# EAGLE design boxiangf-SMD (EAGLE 9.6.2)
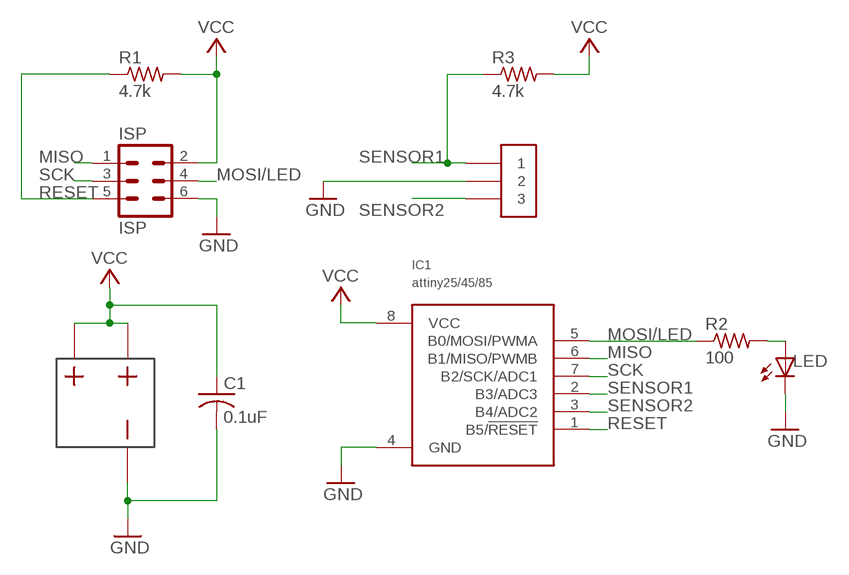
[diagram p0: schematic, sheet 1]

## Parts
C1  0.1uF  CAPACITORSM_CAP  [C0402]
IC1  attiny25/45/85  ATTINY25SM_ATTINY  [8S1]
ISP  ISP  6PINCON_ISPSM_6PIN  [SM6PIN]
LED  LEDSMLED  [CHIPLED_0603]
R1  4.7k  RESISTORSMRESISTOR  [R0402]
R2  100  RESISTORSMRESISTOR  [R0402]
R3  4.7k  RESISTORSMRESISTOR  [R0402]
SENSE  3PINCONSM_3PIN  [SM3PIN]
US1  BATTERYSM_BA2032  [BA2032SM]

## Nets
GND: C1.2 IC1.4(GND) ISP.6 LED.C SENSE.2 US1.1
MISO: IC1.6(B1/MISO/PWMB) ISP.1
MOSI/LED: IC1.5(B0/MOSI/PWMA) ISP.4 R2.1
N$2: LED.A R2.2
RESET: IC1.1(B5/!RESET) ISP.5 R1.1
SCK: IC1.7(B2/SCK/ADC1) ISP.3
SENSOR1: IC1.2(B3/ADC3) R3.1 SENSE.1
SENSOR2: IC1.3(B4/ADC2) SENSE.3
VCC: C1.1 IC1.8(VCC) ISP.2 R1.2 R3.2 US1.2 US1.3

## Library data of the parts
C1 = TinyGadget:CAPACITOR
IC1 = TinyGadget:ATTINY25
ISP = TinyGadget:6PINCON_ISP
LED = TinyGadget:LED
R1-R3 = TinyGadget:RESISTOR
SENSE = TinyGadget:3PINCON
US1 = TinyGadget:BATTERY

## Board
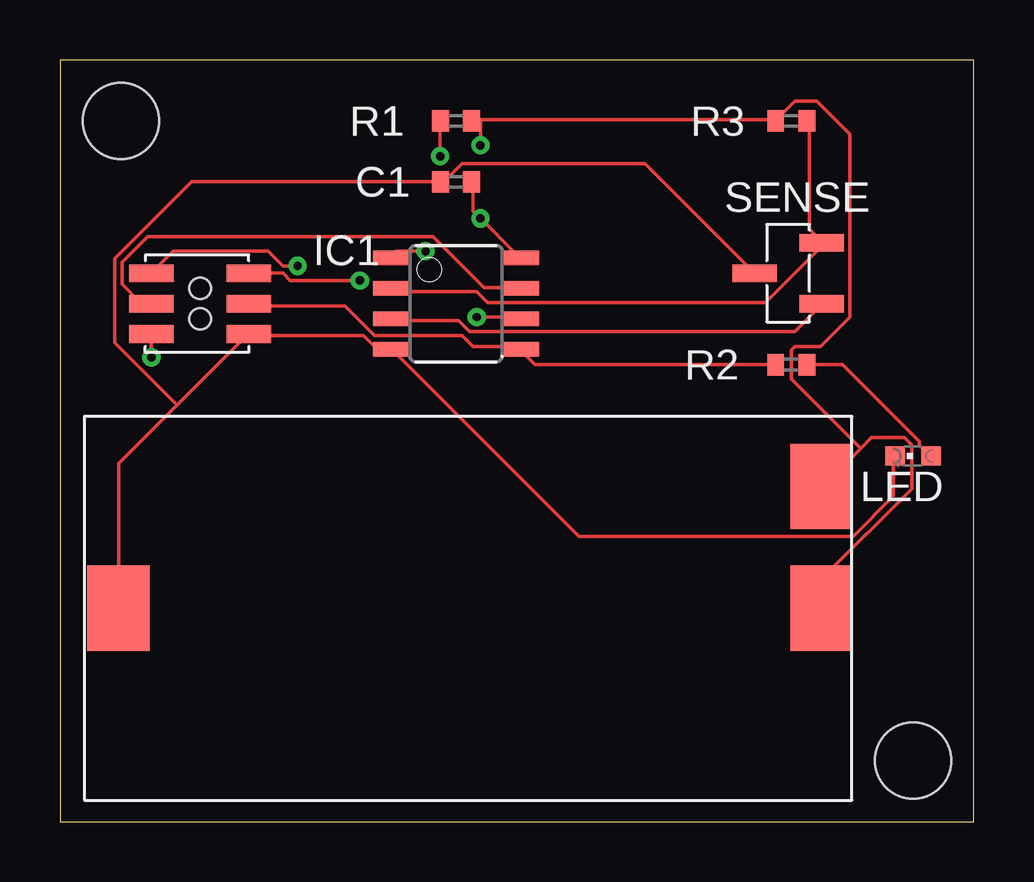
[diagram p1: board, top side]
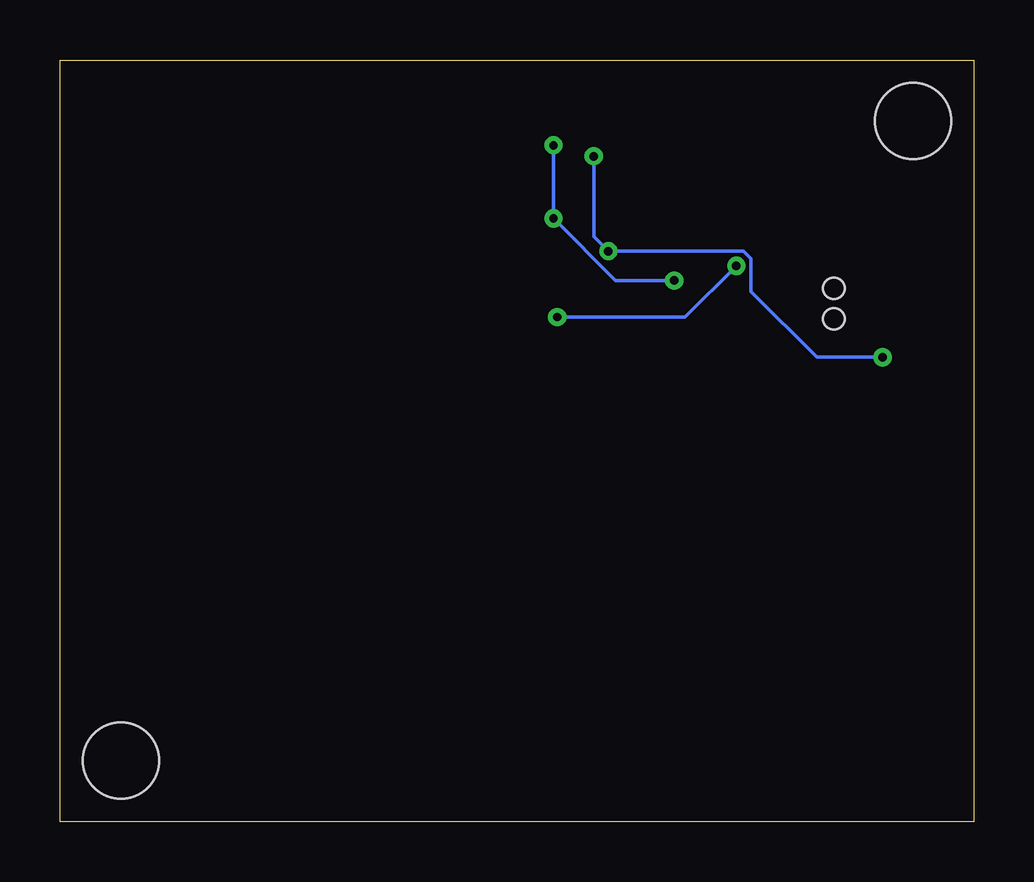
[diagram p2: board, bottom side, seen from below]

Size 38.1 x 31.75 mm. Coordinates in mm from the lower left corner, seen from the top.
Outline: 0,0 38.1,0 38.1,31.75 0,31.75 0,0
Copper layers (1*16): Top 0.035mm / dielectric 1.5mm / Bottom 0.035mm
Design rules "default *": minimum track width 6mil, minimum drill 0.35mm, track to track 6mil, track to pad 6mil, pad to pad 6mil, via to via 6mil, smd to smd 6mil, copper to edge 25mil, drill to drill 6mil, minimum pad ring 10mil, minimum via ring 8mil, stop-mask expansion 4mil, vias tented up to drill 0mil, thermal gap 5mil
Holes 3.17 mm at 2.54,29.21 35.56,2.54

### Footprints (pad centres in the part's own frame; a part is rotated, then mirrored left to right if it is on the bottom)
C0402 = smd 0.7 x 0.9: 1 -0.65,0; 2 0.65,0
8S1 = smd 0.6 x 1.6: 1 -1.905,-2.654; 2 -0.645,-2.654; 3 0.625,-2.654; 4 1.895,-2.654; 5 1.905,2.654; 6 0.635,2.654; 7 -0.635,2.654; 8 -1.905,2.654
SM6PIN = smd 0.737 x 1.854: 1 0,-1.27; 2 0,2.794; 3 1.27,-1.27; 4 1.27,2.794; 5 2.54,-1.27; 6 2.54,2.794 | hole 0.889: 0.635,0.762; 1.905,0.762
CHIPLED_0603 = smd 0.8 x 0.8: A 0,-0.75; C 0,0.75
R0402 = smd 0.7 x 0.9: 1 -0.65,0; 2 0.65,0
SM3PIN = smd 0.737 x 1.854: 1 0,0; 2 1.27,-2.794; 3 2.54,0
BA2032SM = smd 2.591 x 3.556: 1 29.312,0; 2 0,-5.08; 3 0,0

### Placement (x,y rotation side)
C1  16.51,26.67 180 top
IC1  16.51,21.59 270 top
ISP  5.08,22.86 270 top
LED  35.56,15.24 90 top
R1  16.51,29.21 0 top
R2  30.48,19.05 0 top
R3  30.48,29.21 180 top
SENSE  31.75,24.13 270 top
US1  31.75,8.89 180 top

### Tracks (layer width: path | path; a pad name or v marks a point on that pad's centre or on a via)
GND
  Top 0.152: SENSE.2 24.38,27.43 16.76,27.43 16,26.67 C1.2 5.49,26.67 2.29,23.47 2.29,19.96 4.88,17.37 | LED.C 34.75,15.24 34.75,13.56 33.07,11.89 21.64,11.89 13.87,19.66 IC1.4 13.72,19.81 13.11,19.81 12.65,20.27 7.92,20.27 ISP.6 7.77,20.27 4.88,17.37 | US1.1 2.44,14.94 4.88,17.37
MISO  (via drill 0.35)
  Top 0.152: v17.37,21.03 19.05,21.03 IC1.6 | v9.91,23.16 9.3,23.16 8.69,23.77 4.72,23.77 ISP.1
  Bottom 0.152: v17.37,21.03 12.04,21.03 v9.91,23.16
MOSI/LED
  Top 0.152: R2.1 19.81,19.05 19.2,19.66 IC1.5 19.05,19.81 17.22,19.81 16.76,20.27 13.11,20.27 11.89,21.49 7.92,21.49 ISP.4
N$2
  Top 0.152: R2.2 32.61,19.05 35.81,15.85 35.81,15.7 36.27,15.24 LED.A
RESET  (via drill 0.35)
  Top 0.152: v15.85,27.74 15.85,29.11 R1.1 | v15.24,23.77 14.02,23.77 13.87,23.62 IC1.1 | v3.81,19.36 ISP.5
  Bottom 0.152: v15.85,27.74 15.85,24.38 v15.24,23.77 9.6,23.77 9.3,23.47 9.3,22.1 6.55,19.36 v3.81,19.36
SCK
  Top 0.152: IC1.7 19.05,22.25 17.68,22.25 15.54,24.38 3.66,24.38 2.59,23.32 2.59,22.4 3.35,21.64 3.81,21.64 ISP.3
SENSOR1
  Top 0.152: R3.1 31.24,29.11 31.24,24.69 31.7,24.23 SENSE.1 31.85,24.08 29.41,21.64 17.83,21.64 17.37,22.1 13.87,22.1 IC1.2
SENSOR2
  Top 0.152: IC1.3 13.87,20.88 16.61,20.88 17.07,20.42 30.63,20.42 31.7,21.49 SENSE.3
VCC  (via drill 0.35)
  Top 0.152: C1.1 17.22,26.67 17.22,25.45 v17.53,25.15 19.05,23.62 IC1.8 | ISP.2 9.3,22.86 9.6,22.55 v12.5,22.55 | 17.53,29.26 29.72,29.26 R3.2 29.87,29.26 30.63,30.02 31.55,30.02 32.92,28.65 32.92,21.03 31.7,19.81 30.63,19.81 30.48,19.66 30.48,18.44 33.38,15.54 | 17.53,29.26 17.22,29.26 R1.2 | 33.38,15.54 31.85,14.02 US1.2 | 33.38,15.54 33.83,16 35.2,16 35.51,15.7 35.51,13.87 31.85,10.21 31.85,8.99 US1.3 | 17.53,29.26 v17.53,28.19
  Bottom 0.152: v12.5,22.55 14.94,22.55 v17.53,25.15 v17.53,28.19